# Altium schematic sheet Row.SchDoc
size A
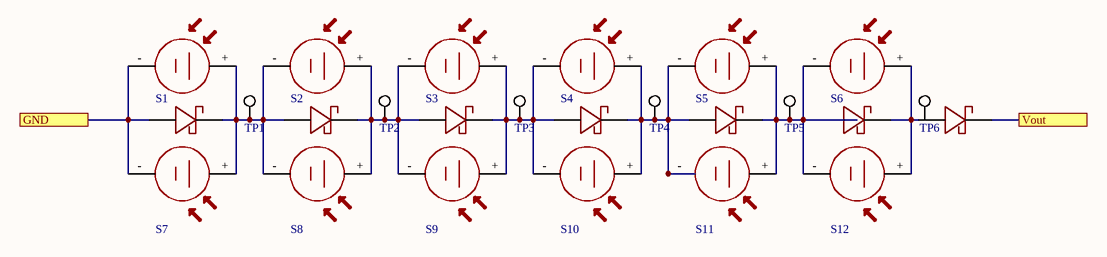
[diagram p0: Row.SchDoc]

## Parts
D1  SCHOTTKY_DIODE_B120-FDICT-NDSCHOTTKY_DIODE_B120-FDICT-ND  [SB_DIODE]  (value not drawn)
D2  SCHOTTKY_DIODE_B120-FDICT-NDSCHOTTKY_DIODE_B120-FDICT-ND  [SB_DIODE]  (value not drawn)
D3  SCHOTTKY_DIODE_B120-FDICT-NDSCHOTTKY_DIODE_B120-FDICT-ND  [SB_DIODE]  (value not drawn)
D4  SCHOTTKY_DIODE_B120-FDICT-NDSCHOTTKY_DIODE_B120-FDICT-ND  [SB_DIODE]  (value not drawn)
D5  SCHOTTKY_DIODE_B120-FDICT-NDSCHOTTKY_DIODE_B120-FDICT-ND  [SB_DIODE]  (value not drawn)
D6  SCHOTTKY_DIODE_B120-FDICT-NDSCHOTTKY_DIODE_B120-FDICT-ND  [SB_DIODE]  (value not drawn)
D7  SCHOTTKY_DIODE_B120-FDICT-NDSCHOTTKY_DIODE_B120-FDICT-ND  [SB_DIODE]  (value not drawn)
S1  SOLAR_CELL  [SOLAR_CELL]  (value not drawn)
S2  SOLAR_CELL  [SOLAR_CELL]  (value not drawn)
S3  SOLAR_CELL  [SOLAR_CELL]  (value not drawn)
S4  SOLAR_CELL  [SOLAR_CELL]  (value not drawn)
S5  SOLAR_CELL  [SOLAR_CELL]  (value not drawn)
S6  SOLAR_CELL  [SOLAR_CELL]  (value not drawn)
S7  SOLAR_CELL  [SOLAR_CELL]  (value not drawn)
S8  SOLAR_CELL  [SOLAR_CELL]  (value not drawn)
S9  SOLAR_CELL  [SOLAR_CELL]  (value not drawn)
S10  SOLAR_CELL  [SOLAR_CELL]  (value not drawn)
S11  SOLAR_CELL  [SOLAR_CELL]  (value not drawn)
S12  SOLAR_CELL  [SOLAR_CELL]  (value not drawn)
TP1  TEST_POINT  [TEST_POINT]  (value not drawn)
TP2  TEST_POINT  [TEST_POINT]  (value not drawn)
TP3  TEST_POINT  [TEST_POINT]  (value not drawn)
TP4  TEST_POINT  [TEST_POINT]  (value not drawn)
TP5  TEST_POINT  [TEST_POINT]  (value not drawn)
TP6  TEST_POINT  [TEST_POINT]  (value not drawn)

## Ports
GND, Vout

## Nets
GND: D1.POS S1.- S7.- ; port GND
Vout: D7.NEG ; port Vout
NetD1_NEG: D1.NEG D2.POS S1.+ S2.- S7.+ S8.- TP1.38
NetD2_NEG: D2.NEG D3.POS S2.+ S3.- S8.+ S9.- TP2.38
NetD3_NEG: D3.NEG D4.POS S3.+ S4.- S9.+ S10.- TP3.38
NetD4_NEG: D4.NEG D5.POS S4.+ S5.- S10.+ S11.- TP4.38
NetD5_NEG: D5.NEG S5.+ S6.- S11.+ S12.- TP5.38
NetD6_NEG: D6.NEG D7.POS S6.+ S12.+

Not connected (* = marked no-connect by the designer): TP6 38

## Library data of the parts
D1-D7 = SCHOTTKY_DIODE_B120-FDICT-NDSCHOTTKY_DIODE_B120-FDICT-ND: GateName_1: G$1; SymbolName_1: SCHOTTKY_DIODE_B120-FDICT-ND; DeviceName: SCHOTTKY_DIODE_B120-FDICT-ND; LibraryName: Solar_Fadi; DeviceSetName: SCHOTTKY_DIODE_B120-FDICT-ND; Package: SCHOTTKY_DIODE_B120-FDICT-ND
TP1-TP6 = TEST_POINT: pin to pad: 38>PAD